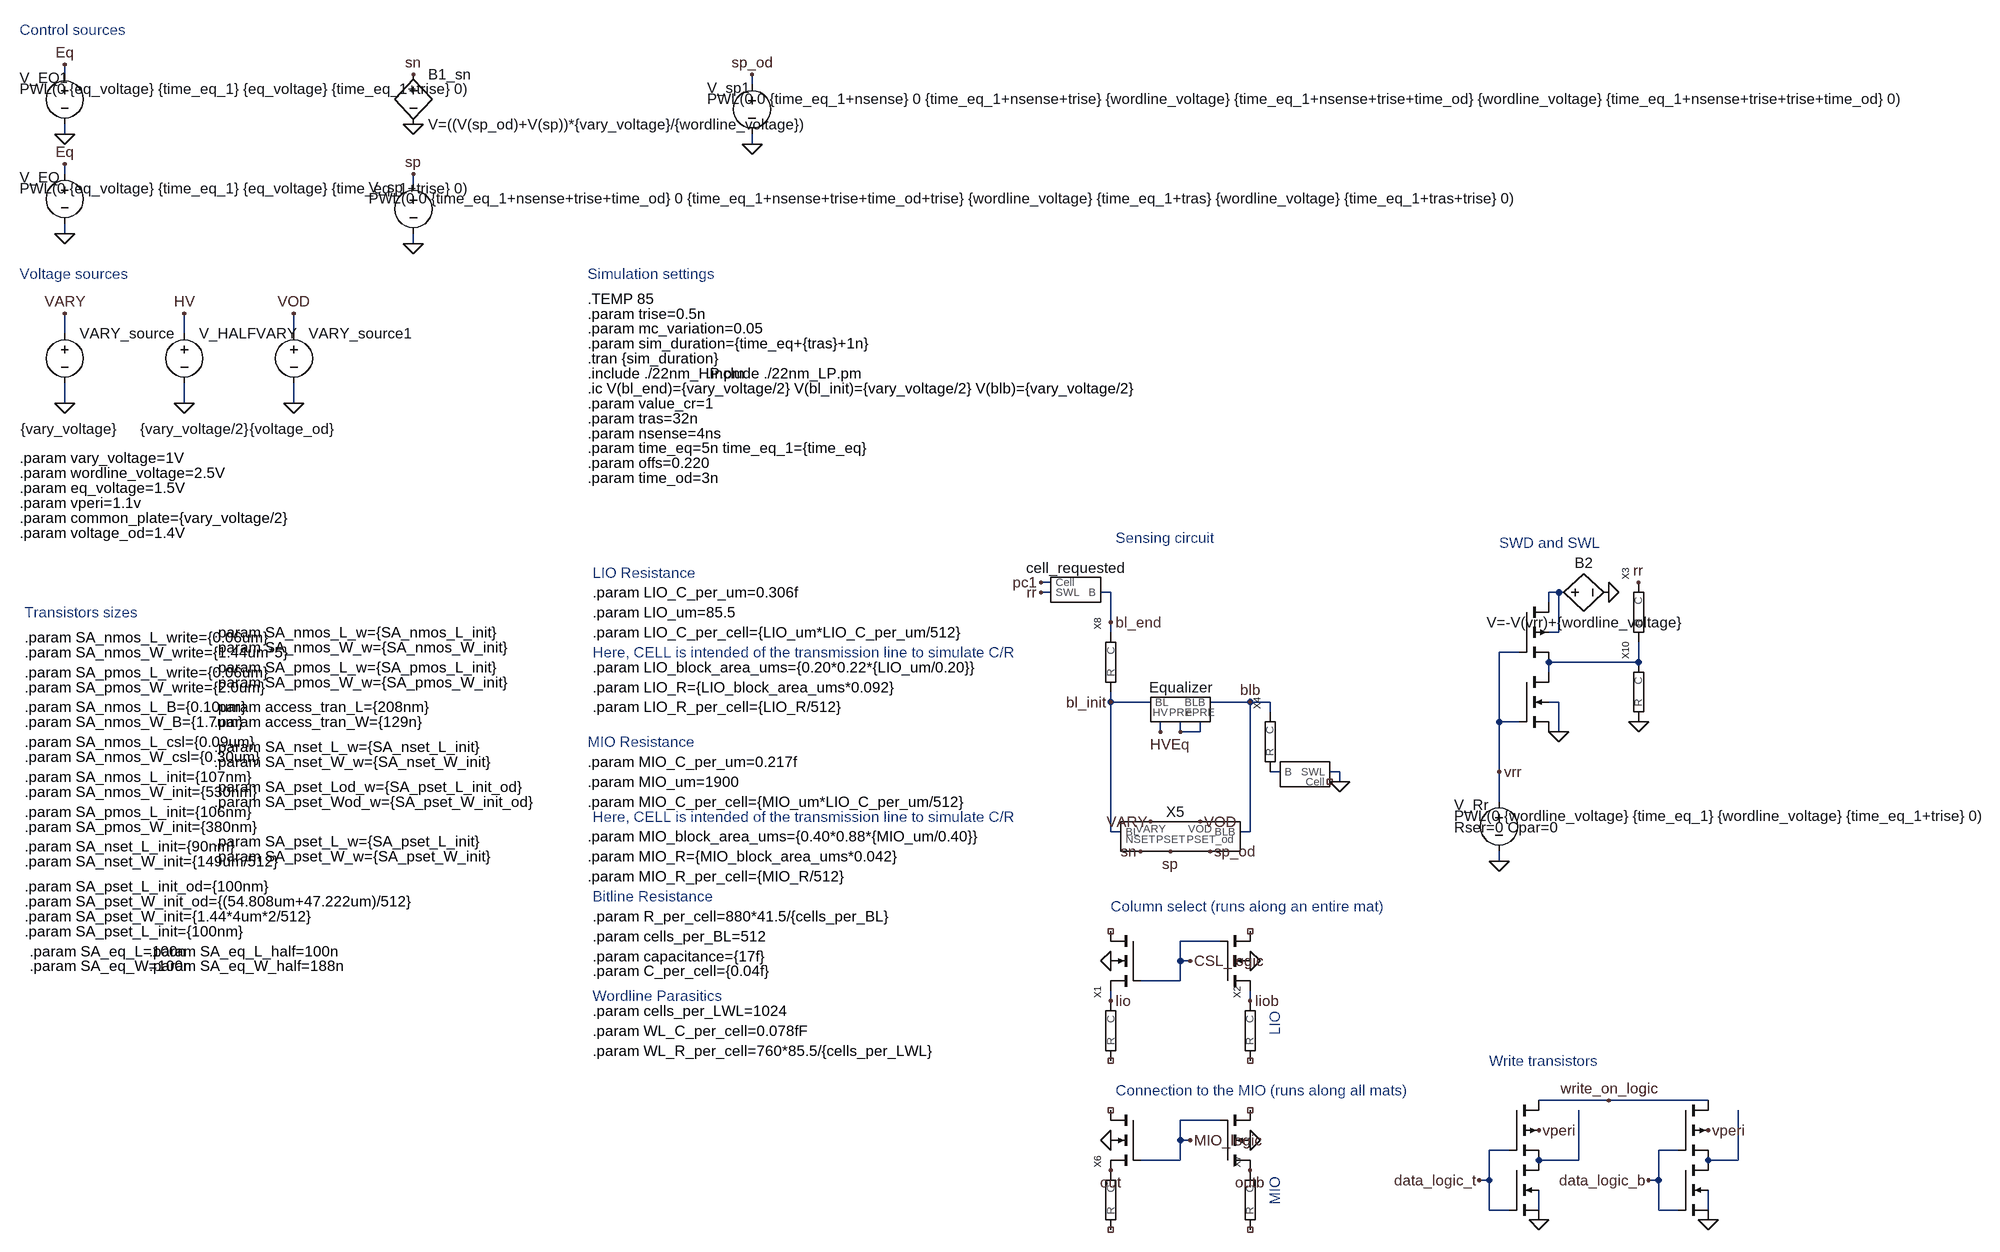
[diagram p0: schematic REM.asc]
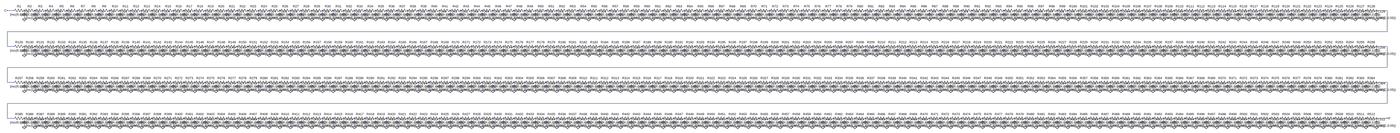
[diagram p1: sub-circuit transmission_line.asc, whole sheet]
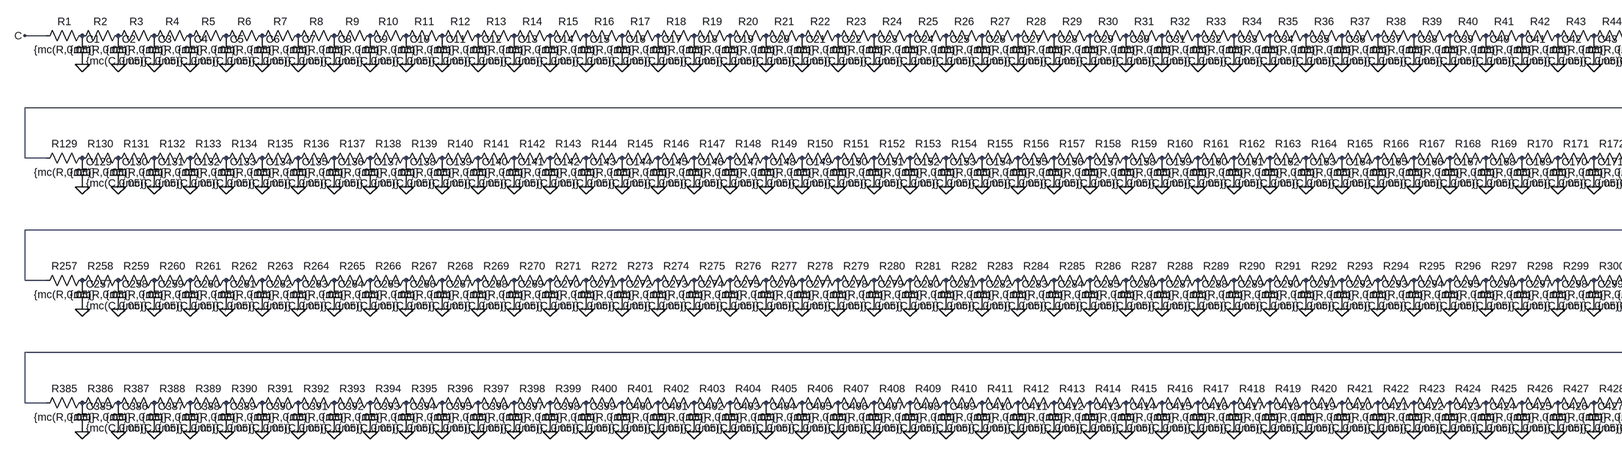
[diagram p2: sub-circuit transmission_line.asc, part, row 1 of 1, column 1 of 3]
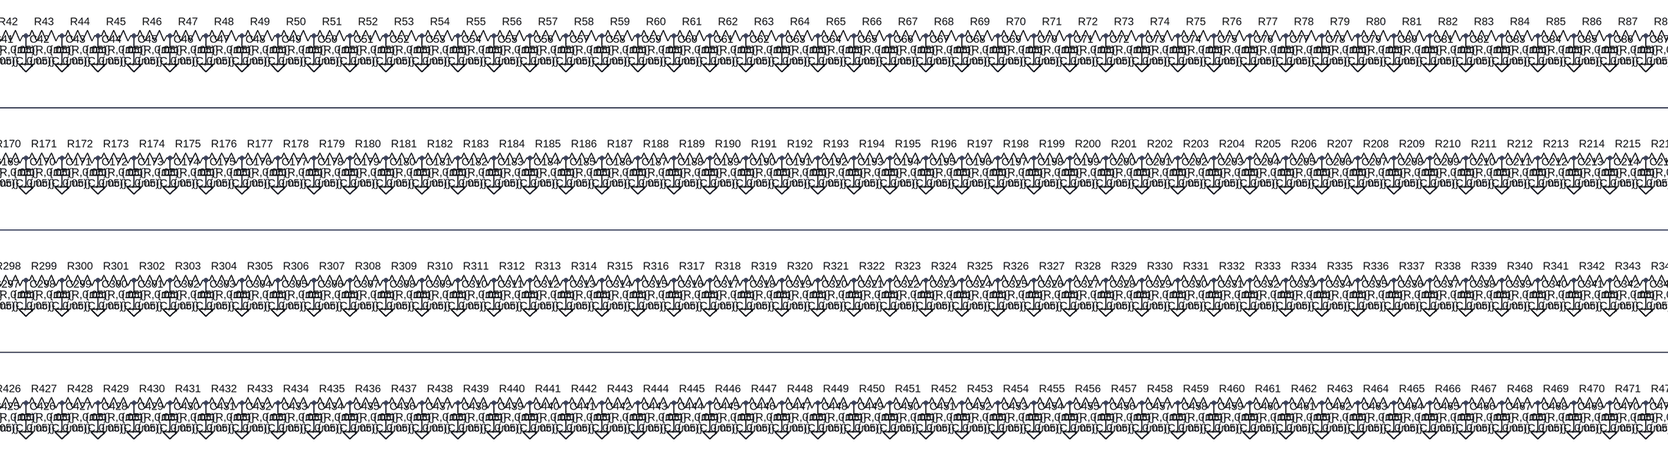
[diagram p3: sub-circuit transmission_line.asc, part, row 1 of 1, column 2 of 3]
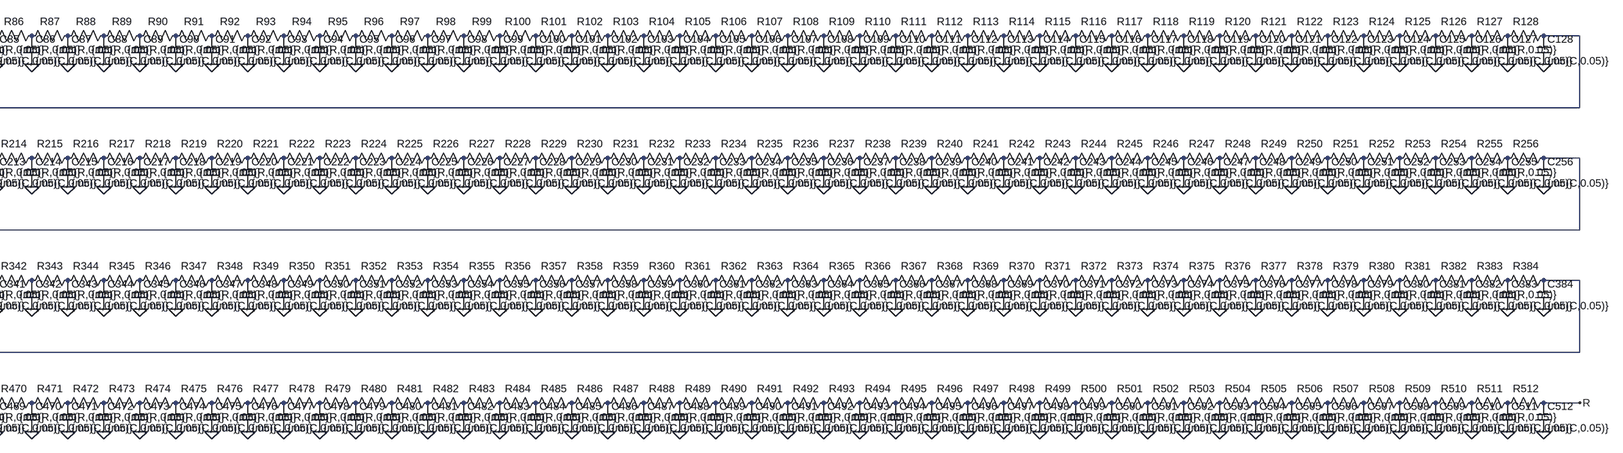
[diagram p4: sub-circuit transmission_line.asc, part, row 1 of 1, column 3 of 3]
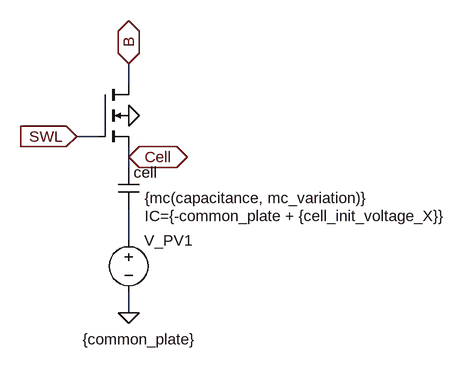
[diagram p5: sub-circuit dram_cell.asc]
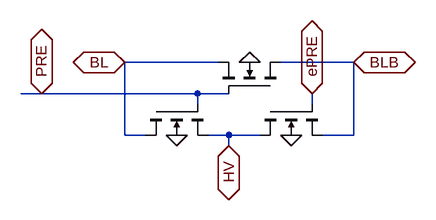
[diagram p6: sub-circuit equalizer.asc]
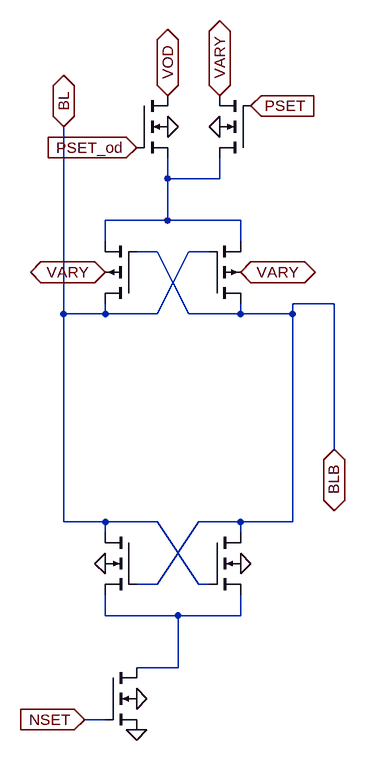
[diagram p7: sub-circuit sense_amplifier.asc]
REM.asc, the LTspice schematic file:
Version 4
SHEET 1 9124 2520
WIRE -800 -1040 -800 -1056
WIRE 304 -1024 304 -1040
WIRE -800 -944 -800 -960
WIRE 304 -928 304 -944
WIRE -800 -880 -800 -896
WIRE -240 -864 -240 -880
WIRE -800 -784 -800 -800
WIRE -240 -768 -240 -784
WIRE -800 -624 -800 -656
WIRE -608 -624 -608 -656
WIRE -432 -624 -432 -656
WIRE -800 -512 -800 -544
WIRE -608 -512 -608 -544
WIRE -432 -512 -432 -544
WIRE 784 -224 768 -224
WIRE 784 -208 768 -208
WIRE 880 -208 864 -208
WIRE 1600 -208 1584 -208
WIRE 1584 -192 1584 -208
WIRE 880 -160 880 -208
WIRE 880 -144 880 -160
WIRE 1600 -144 1600 -208
WIRE 1600 -144 1584 -144
WIRE 1536 -112 1504 -112
WIRE 1728 -96 1728 -128
WIRE 1728 -96 1584 -96
WIRE 1584 -80 1584 -96
WIRE 880 -32 880 -48
WIRE 944 -32 880 -32
WIRE 1104 -32 1040 -32
WIRE 1136 -32 1104 -32
WIRE 1600 -32 1584 -32
WIRE 1136 -16 1136 -32
WIRE 1504 0 1504 -112
WIRE 1536 0 1504 0
WIRE 960 16 960 0
WIRE 992 16 992 0
WIRE 1024 16 1024 0
WIRE 1024 16 992 16
WIRE 1600 16 1600 -32
WIRE 1600 16 1584 16
WIRE 1152 80 1136 80
WIRE 1248 80 1232 80
WIRE 1504 80 1504 0
WIRE 1248 96 1248 80
WIRE 1504 128 1504 80
WIRE 880 176 880 -32
WIRE 896 176 880 176
WIRE 1104 176 1104 -32
WIRE 1104 176 1088 176
WIRE 1504 224 1504 208
WIRE 1056 352 992 352
WIRE 992 384 992 352
WIRE 1008 384 992 384
WIRE 992 416 992 384
WIRE 992 416 928 416
WIRE 880 448 880 432
WIRE 1104 448 1104 432
WIRE 1680 608 1568 608
WIRE 1840 608 1680 608
WIRE 1056 640 992 640
WIRE 992 672 992 640
WIRE 1008 672 992 672
WIRE 1520 688 1488 688
WIRE 1792 688 1760 688
WIRE 992 704 992 672
WIRE 992 704 928 704
WIRE 1632 704 1632 624
WIRE 1632 704 1568 704
WIRE 1888 704 1888 624
WIRE 1888 704 1840 704
WIRE 1488 736 1488 688
WIRE 1488 736 1472 736
WIRE 1760 736 1760 688
WIRE 1760 736 1744 736
WIRE 1488 784 1488 736
WIRE 1520 784 1488 784
WIRE 1568 784 1568 752
WIRE 1760 784 1760 736
WIRE 1792 784 1760 784
WIRE 1840 784 1840 752
FLAG -800 -784 0
FLAG -800 -896 Eq
FLAG -800 -512 0
FLAG -800 -656 VARY
FLAG -608 -512 0
FLAG -608 -656 HV
FLAG 768 -208 rr
FLAG 768 -224 pc1
FLAG 1248 96 0
FLAG 880 -160 bl_end
FLAG 880 -32 bl_init
FLAG 960 16 HV
FLAG 992 16 Eq
FLAG -240 -960 0
FLAG -240 -1040 sn
FLAG -240 -768 0
FLAG -240 -880 sp
FLAG -432 -512 0
FLAG -432 -656 VOD
FLAG 1024 160 VOD
FLAG 928 208 sn
FLAG 1104 -32 blb
FLAG 944 160 VARY
FLAG 976 208 sp
FLAG 1040 208 sp_od
FLAG 304 -928 0
FLAG 304 -1040 sp_od
FLAG 1504 224 0
FLAG 1728 -224 rr
FLAG 1600 16 0
FLAG 1680 -208 0
FLAG 1504 80 vrr
FLAG 1728 0 0
FLAG -800 -944 0
FLAG -800 -1056 Eq
FLAG 1008 384 CSL_logic
FLAG 1104 384 0
FLAG 880 384 0
FLAG 880 448 lio
FLAG 1104 448 liob
FLAG 880 720 out
FLAG 1104 720 outb
FLAG 1008 672 MIO_logic
FLAG 1104 672 0
FLAG 880 672 0
FLAG 1568 800 0
FLAG 1680 608 write_on_logic
FLAG 1472 736 data_logic_t
FLAG 1568 656 vperi
FLAG 1840 800 0
FLAG 1744 736 data_logic_b
FLAG 1840 656 vperi
DATAFLAG 304 -1056 ""
DATAFLAG 304 -1056 ""
DATAFLAG 304 -1056 ""
DATAFLAG 768 -224 ""
DATAFLAG 768 -224 ""
DATAFLAG 768 -224 ""
DATAFLAG 768 -224 ""
SYMBOL voltage -800 -896 R0
WINDOW 0 -72 21 Left 2
WINDOW 3 -72 39 Left 2
WINDOW 123 0 0 Left 2
SYMATTR InstName V_EQ
SYMATTR Value PWL(0 {eq_voltage} {time_eq_1} {eq_voltage} {time_eq_1+trise} 0)
SYMATTR SpiceLine Rser=100 Cpar=1f
SYMBOL voltage -800 -640 R0
WINDOW 123 0 0 Left 2
WINDOW 39 -71 197 Left 2
WINDOW 3 -71 169 Left 2
SYMATTR Value {vary_voltage}
SYMATTR InstName VARY_source
SYMBOL voltage -608 -640 R0
WINDOW 123 0 0 Left 2
WINDOW 39 -71 197 Left 2
WINDOW 3 -71 169 Left 2
SYMATTR Value {vary_voltage/2}
SYMATTR InstName V_HALFVARY
SYMBOL transmission_line 1136 32 R270
SYMATTR InstName X4
SYMATTR SpiceLine R=R_per_cell C=C_per_cell
SYMBOL dram_cell 848 -192 R0
SYMATTR SpiceLine cell_init_voltage_X={if(value_cr==0,{vary_voltage/2-offs},{vary_voltage/2+offs})}
SYMATTR InstName cell_requested
SYMBOL dram_cell 1168 64 R180
WINDOW 0 -25 -40 Invisible 2
SYMATTR InstName cell3
SYMATTR SpiceLine cell_init_voltage_X={if(value_cr==0,{vary_voltage/2-offs},{vary_voltage/2+offs})}
SYMBOL transmission_line 880 -96 R270
SYMATTR InstName X8
SYMATTR SpiceLine R=R_per_cell C=C_per_cell
SYMBOL equalizer 976 16 R0
SYMATTR InstName Equalizer
SYMBOL bv -240 -1056 R0
SYMATTR InstName B1_sn
SYMATTR Value V=((V(sp_od)+V(sp))*{vary_voltage}/{wordline_voltage})
SYMBOL voltage -240 -880 R0
WINDOW 0 -72 21 Left 2
WINDOW 3 -72 39 Left 2
WINDOW 123 0 0 Left 2
SYMATTR InstName V_sp
SYMATTR Value PWL(0 0 {time_eq_1+nsense+trise+time_od} 0 {time_eq_1+nsense+trise+time_od+trise} {wordline_voltage} {time_eq_1+tras} {wordline_voltage} {time_eq_1+tras+trise} 0)
SYMATTR SpiceLine Rser=100 Cpar=1f
SYMBOL voltage -432 -640 R0
WINDOW 123 0 0 Left 2
WINDOW 39 -71 197 Left 2
WINDOW 3 -71 169 Left 2
SYMATTR Value {voltage_od}
SYMATTR InstName VARY_source1
SYMBOL sense_amplifier 960 224 R0
SYMATTR InstName X5
SYMATTR SpiceLine SA_nmos_L_=SA_nmos_L_w SA_nmos_W_=SA_nmos_W_w SA_pmos_L_=SA_pmos_L_w SA_pmos_W_=SA_pmos_W_w SA_nset_L_=SA_nset_L_w SA_nset_W_=SA_nset_W_w SA_pset_W_=SA_pset_W_w SA_pset_L_=SA_pset_L_w  SA_pset_Lod_=SA_pset_Lod_w SA_pset_Wod_=SA_pset_Wod_w
SYMBOL voltage 304 -1040 R0
WINDOW 0 -72 21 Left 2
WINDOW 3 -72 39 Left 2
WINDOW 123 0 0 Left 2
SYMATTR InstName V_sp1
SYMATTR Value PWL(0 0 {time_eq_1+nsense} 0 {time_eq_1+nsense+trise} {wordline_voltage} {time_eq_1+nsense+trise+time_od} {wordline_voltage} {time_eq_1+nsense+trise+trise+time_od} 0)
SYMATTR SpiceLine Rser=100 Cpar=1f
SYMBOL voltage 1504 112 R0
WINDOW 0 -72 21 Left 2
WINDOW 3 -72 39 Left 2
WINDOW 123 0 0 Left 2
WINDOW 39 -72 57 Left 2
SYMATTR InstName V_Rr
SYMATTR Value PWL(0 {wordline_voltage} {time_eq_1} {wordline_voltage} {time_eq_1+trise} 0)
SYMATTR SpiceLine Rser=0 Cpar=0
SYMBOL transmission_line 1728 -176 R270
SYMATTR SpiceLine R=WL_R_per_cell C=WL_C_per_cell
SYMATTR InstName X3
SYMBOL transmission_line 1728 -48 R270
SYMATTR SpiceLine R=WL_R_per_cell C=WL_C_per_cell
SYMATTR InstName X10
SYMBOL nmos4 1536 -80 R0
WINDOW 0 104 24 Invisible 2
WINDOW 3 179 41 Invisible 2
SYMATTR InstName M13
SYMATTR Value2 l={mc(0.1u,0.05)} w={mc(0.256u,0.05)}
SYMBOL pmos4 1536 -192 R0
WINDOW 0 56 32 Invisible 2
WINDOW 3 56 72 Invisible 2
SYMATTR InstName M14
SYMATTR Value2 l={mc(0.104u,0.05)} w={mc(0.908u,0.05)}
SYMBOL bv 1584 -208 R270
WINDOW 0 32 56 VTop 2
WINDOW 3 -32 56 VBottom 2
SYMATTR InstName B2
SYMATTR Value V=-V(vrr)+{wordline_voltage}
SYMBOL voltage -800 -1056 R0
WINDOW 0 -72 21 Left 2
WINDOW 3 -72 39 Left 2
WINDOW 123 0 0 Left 2
SYMATTR InstName V_EQ1
SYMATTR Value PWL(0 {eq_voltage} {time_eq_1} {eq_voltage} {time_eq_1+trise} 0)
SYMATTR SpiceLine Rser=100 Cpar=1f
SYMBOL nmos4 1056 432 M180
WINDOW 0 104 24 Invisible 2
WINDOW 3 179 41 Invisible 2
SYMATTR InstName M1
SYMATTR Value2 l={mc({SA_nmos_L_csl},mc_variation)} w={mc({SA_nmos_W_csl},mc_variation)}
SYMBOL nmos4 928 336 M0
WINDOW 0 104 24 Invisible 2
WINDOW 3 179 41 Invisible 2
SYMATTR InstName M2
SYMATTR Value2 l={mc({SA_nmos_L_csl},mc_variation)} w={mc({SA_nmos_W_csl},mc_variation)}
SYMBOL transmission_line 880 496 R270
SYMATTR InstName X1
SYMATTR SpiceLine R=LIO_R_per_cell C=LIO_C_per_cell
SYMBOL transmission_line 1104 496 R270
SYMATTR InstName X2
SYMATTR SpiceLine R=R_per_cell C=LIO_C_per_cell
SYMBOL transmission_line 880 768 R270
SYMATTR InstName X6
SYMATTR SpiceLine R=MIO_R_per_cell C=MIO_C_per_cell
SYMBOL transmission_line 1104 768 R270
SYMATTR InstName X7
SYMATTR SpiceLine R=R_per_cell C=LIO_C_per_cell
SYMBOL nmos4 928 624 M0
WINDOW 0 104 24 Invisible 2
WINDOW 3 179 41 Invisible 2
SYMATTR InstName M3
SYMATTR Value2 l={mc({SA_nmos_L_B},mc_variation)} w={mc({SA_nmos_W_B},mc_variation)}
SYMBOL nmos4 1056 720 M180
WINDOW 0 104 24 Invisible 2
WINDOW 3 179 41 Invisible 2
SYMATTR InstName M4
SYMATTR Value2 l={mc({SA_nmos_L_B},mc_variation)} w={mc({SA_nmos_W_B},mc_variation)}
SYMBOL nmos4 1520 704 R0
WINDOW 0 56 32 Invisible 2
WINDOW 3 56 72 Invisible 2
SYMATTR InstName M5
SYMATTR Value2 l={mc(SA_nmos_L_write, mc_variation)} w={mc(SA_nmos_W_write, mc_variation)}
SYMBOL pmos4 1520 608 R0
WINDOW 0 56 32 Invisible 2
WINDOW 3 56 72 Invisible 2
SYMATTR InstName M6
SYMATTR Value2 l={mc(SA_pmos_L_write, mc_variation)} w={mc(SA_pmos_W_write, mc_variation)}
SYMBOL nmos4 1792 704 R0
WINDOW 0 56 32 Invisible 2
WINDOW 3 56 72 Invisible 2
SYMATTR InstName M7
SYMATTR Value2 l={mc(SA_nmos_L_write, mc_variation)} w={mc(SA_nmos_W_write, mc_variation)}
SYMBOL pmos4 1792 608 R0
WINDOW 0 56 32 Invisible 2
WINDOW 3 56 72 Invisible 2
SYMATTR InstName M8
SYMATTR Value2 l={mc(SA_pmos_L_write, mc_variation)} w={mc(SA_pmos_W_write, mc_variation)}
TEXT 40 -560 Left 2 !.include ./22nm_HP.pm
TEXT 40 -584 Left 2 !.tran {sim_duration}
TEXT 40 -632 Left 2 !.param mc_variation=0.05
TEXT 48 376 Left 2 !.param capacitance={17f}
TEXT 48 400 Left 2 !.param C_per_cell={0.04f}
TEXT -560 -24 Left 2 !.param access_tran_L={208nm}
TEXT -560 0 Left 2 !.param access_tran_W={129n}
TEXT 48 312 Left 2 !.param R_per_cell=880*41.5/{cells_per_BL}
TEXT 48 280 Left 2 ;Bitline Resistance
TEXT -856 368 Left 2 !.param SA_eq_L=100n
TEXT -856 392 Left 2 !.param SA_eq_W=100n
TEXT 48 344 Left 2 !.param cells_per_BL=512
TEXT -872 -424 Left 2 !.param vary_voltage=1V
TEXT -872 -400 Left 2 !.param wordline_voltage=2.5V
TEXT -872 -328 Left 2 !.param common_plate={vary_voltage/2}
TEXT 40 -464 Left 2 !.param nsense=4ns
TEXT 48 496 Left 2 !.param WL_C_per_cell=0.078fF
TEXT 48 440 Left 2 ;Wordline Parasitics
TEXT 48 464 Left 2 !.param cells_per_LWL=1024
TEXT 48 528 Left 2 !.param WL_R_per_cell=760*85.5/{cells_per_LWL}
TEXT 40 -680 Left 2 !.TEMP 85
TEXT 40 -488 Left 2 !.param tras=32n
TEXT 40 -656 Left 2 !.param trise=0.5n
TEXT -560 -144 Left 2 !.param SA_nmos_L_w={SA_nmos_L_init}
TEXT -560 -120 Left 2 !.param SA_nmos_W_w={SA_nmos_W_init}
TEXT -560 -88 Left 2 !.param SA_pmos_L_w={SA_pmos_L_init}
TEXT -560 -64 Left 2 !.param SA_pmos_W_w={SA_pmos_W_init}
TEXT -560 40 Left 2 !.param SA_nset_L_w={SA_nset_L_init}
TEXT -560 64 Left 2 !.param SA_nset_W_w={SA_nset_W_init}
TEXT -560 104 Left 2 !.param SA_pset_Lod_w={SA_pset_L_init_od}
TEXT -560 128 Left 2 !.param SA_pset_Wod_w={SA_pset_W_init_od}
TEXT 40 -440 Left 2 !.param time_eq=5n time_eq_1={time_eq}
TEXT 40 -608 Left 2 !.param sim_duration={time_eq+{tras}+1n}
TEXT -664 368 Left 2 !.param SA_eq_L_half=100n
TEXT -664 392 Left 2 !.param SA_eq_W_half=188n
TEXT -864 88 Left 2 !.param SA_nmos_L_init={107nm}
TEXT -864 112 Left 2 !.param SA_nmos_W_init={530nm}
TEXT -864 144 Left 2 !.param SA_pmos_L_init={106nm}
TEXT -864 168 Left 2 !.param SA_pmos_W_init={380nm}
TEXT -864 200 Left 2 !.param SA_nset_L_init={90nm}
TEXT -864 224 Left 2 !.param SA_nset_W_init={149um/512}
TEXT -864 264 Left 2 !.param SA_pset_L_init_od={100nm}
TEXT -864 288 Left 2 !.param SA_pset_W_init_od={(54.808um+47.222um)/512}
TEXT -864 312 Left 2 !.param SA_pset_W_init={1.44*4um*2/512}
TEXT 40 -536 Left 2 !.ic V(bl_end)={vary_voltage/2} V(bl_init)={vary_voltage/2} V(blb)={vary_voltage/2}
TEXT -872 -376 Left 2 !.param eq_voltage=1.5V
TEXT 48 -144 Left 2 !.param LIO_C_per_cell={LIO_um*LIO_C_per_um/512}
TEXT 48 -208 Left 2 !.param LIO_C_per_um=0.306f
TEXT 48 -240 Left 2 ;LIO Resistance
TEXT 48 -176 Left 2 !.param LIO_um=85.5
TEXT 48 -112 Left 2 ;Here, CELL is intended of the transmission line to simulate C/R
TEXT 48 -88 Left 2 !.param LIO_block_area_ums={0.20*0.22*{LIO_um/0.20}}
TEXT 48 -56 Left 2 !.param LIO_R={LIO_block_area_ums*0.092}
TEXT 48 -24 Left 2 !.param LIO_R_per_cell={LIO_R/512}
TEXT 40 128 Left 2 !.param MIO_C_per_cell={MIO_um*LIO_C_per_um/512}
TEXT 40 64 Left 2 !.param MIO_C_per_um=0.217f
TEXT 40 32 Left 2 ;MIO Resistance
TEXT 40 96 Left 2 !.param MIO_um=1900
TEXT 48 152 Left 2 ;Here, CELL is intended of the transmission line to simulate C/R
TEXT 40 184 Left 2 !.param MIO_block_area_ums={0.40*0.88*{MIO_um/0.40}}
TEXT 40 216 Left 2 !.param MIO_R={MIO_block_area_ums*0.042}
TEXT 40 248 Left 2 !.param MIO_R_per_cell={MIO_R/512}
TEXT -872 -352 Left 2 !.param vperi=1.1v
TEXT -864 -24 Left 2 !.param SA_nmos_L_B={0.10um}
TEXT -864 0 Left 2 !.param SA_nmos_W_B={1.7um}
TEXT -864 32 Left 2 !.param SA_nmos_L_csl={0.09um}
TEXT -864 56 Left 2 !.param SA_nmos_W_csl={0.30um}
TEXT -864 -136 Left 2 !.param SA_nmos_L_write={0.06um}
TEXT -864 -112 Left 2 !.param SA_nmos_W_write={1.44um*5}
TEXT -864 -80 Left 2 !.param SA_pmos_L_write={0.06um}
TEXT -864 -56 Left 2 !.param SA_pmos_W_write={2.0um}
TEXT 40 -416 Left 2 !.param offs=0.220
TEXT -864 336 Left 2 !.param SA_pset_L_init={100nm}
TEXT -872 -304 Left 2 !.param voltage_od=1.4V
TEXT -560 192 Left 2 !.param SA_pset_L_w={SA_pset_L_init}
TEXT -560 216 Left 2 !.param SA_pset_W_w={SA_pset_W_init}
TEXT 40 -392 Left 2 !.param time_od=3n
TEXT 40 -512 Left 2 !.param value_cr=1
TEXT -872 -720 Left 2 ;Voltage sources
TEXT -872 -1112 Left 2 ;Control sources
TEXT 1504 -288 Left 2 ;SWD and SWL
TEXT 40 -720 Left 2 ;Simulation settings
TEXT -864 -176 Left 2 ;Transistors sizes
TEXT 888 -296 Left 2 ;Sensing circuit
TEXT 880 296 Left 2 ;Column select (runs along an entire mat)
TEXT 1144 504 VLeft 2 ;LIO
TEXT 1144 776 VLeft 2 ;MIO
TEXT 888 592 Left 2 ;Connection to the MIO (runs along all mats)
TEXT 1488 544 Left 2 ;Write transistors
TEXT 232 -560 Left 2 !.include ./22nm_LP.pm

The netlist it stands for:
* REM.asc
V_EQ Eq 0 PWL(0 {eq_voltage} {time_eq_1} {eq_voltage} {time_eq_1+trise} 0) Rser=100 Cpar=1f
VARY_source VARY 0 {vary_voltage}
V_HALFVARY HV 0 {vary_voltage/2}
XX4 N003 blb transmission_line params: R=R_per_cell C=C_per_cell
Xcell_requested rr bl_end pc1 dram_cell params: cell_init_voltage_X={if(value_cr==0,{vary_voltage/2-offs},{vary_voltage/2+offs})}
Xcell3 0 N003 NC_01 dram_cell params: cell_init_voltage_X={if(value_cr==0,{vary_voltage/2-offs},{vary_voltage/2+offs})}
XX8 bl_init bl_end transmission_line params: R=R_per_cell C=C_per_cell
XEqualizer bl_init blb Eq HV Eq equalizer
B1_sn sn 0 V=((V(sp_od)+V(sp))*{vary_voltage}/{wordline_voltage})
V_sp sp 0 PWL(0 0 {time_eq_1+nsense+trise+time_od} 0 {time_eq_1+nsense+trise+time_od+trise} {wordline_voltage} {time_eq_1+tras} {wordline_voltage} {time_eq_1+tras+trise} 0) Rser=100 Cpar=1f
VARY_source1 VOD 0 {voltage_od}
XX5 sn sp sp_od bl_init blb VARY VOD sense_amplifier params: SA_nmos_L_=SA_nmos_L_w SA_nmos_W_=SA_nmos_W_w SA_pmos_L_=SA_pmos_L_w SA_pmos_W_=SA_pmos_W_w SA_nset_L_=SA_nset_L_w SA_nset_W_=SA_nset_W_w SA_pset_W_=SA_pset_W_w SA_pset_L_=SA_pset_L_w  SA_pset_Lod_=SA_pset_Lod_w SA_pset_Wod_=SA_pset_Wod_w
V_sp1 sp_od 0 PWL(0 0 {time_eq_1+nsense} 0 {time_eq_1+nsense+trise} {wordline_voltage} {time_eq_1+nsense+trise+time_od} {wordline_voltage} {time_eq_1+nsense+trise+trise+time_od} 0) Rser=100 Cpar=1f
V_Rr vrr 0 PWL(0 {wordline_voltage} {time_eq_1} {wordline_voltage} {time_eq_1+trise} 0) Rser=0 Cpar=0
XX3 N002 rr transmission_line params: R=WL_R_per_cell C=WL_C_per_cell
XX10 0 N002 transmission_line params: R=WL_R_per_cell C=WL_C_per_cell
M13 N002 vrr 0 0 NMOS l={mc(0.1u,0.05)} w={mc(0.256u,0.05)}
M14 N001 vrr N002 N001 PMOS l={mc(0.104u,0.05)} w={mc(0.908u,0.05)}
B2 N001 0 V=-V(vrr)+{wordline_voltage}
V_EQ1 Eq 0 PWL(0 {eq_voltage} {time_eq_1} {eq_voltage} {time_eq_1+trise} 0) Rser=100 Cpar=1f
M1 liob CSL_logic NC_02 0 NMOS l={mc({SA_nmos_L_csl},mc_variation)} w={mc({SA_nmos_W_csl},mc_variation)}
M2 NC_03 CSL_logic lio 0 NMOS l={mc({SA_nmos_L_csl},mc_variation)} w={mc({SA_nmos_W_csl},mc_variation)}
XX1 NC_04 lio transmission_line params: R=LIO_R_per_cell C=LIO_C_per_cell
XX2 NC_05 liob transmission_line params: R=R_per_cell C=LIO_C_per_cell
XX6 NC_06 out transmission_line params: R=MIO_R_per_cell C=MIO_C_per_cell
XX7 NC_07 outb transmission_line params: R=R_per_cell C=LIO_C_per_cell
M3 NC_08 MIO_logic out 0 NMOS l={mc({SA_nmos_L_B},mc_variation)} w={mc({SA_nmos_W_B},mc_variation)}
M4 outb MIO_logic NC_09 0 NMOS l={mc({SA_nmos_L_B},mc_variation)} w={mc({SA_nmos_W_B},mc_variation)}
M5 N004 data_logic_t 0 N006 NMOS l={mc(SA_nmos_L_write, mc_variation)} w={mc(SA_nmos_W_write, mc_variation)}
M6 write_on_logic data_logic_t N004 vperi PMOS l={mc(SA_pmos_L_write, mc_variation)} w={mc(SA_pmos_W_write, mc_variation)}
M7 N005 data_logic_b 0 N007 NMOS l={mc(SA_nmos_L_write, mc_variation)} w={mc(SA_nmos_W_write, mc_variation)}
M8 write_on_logic data_logic_b N005 vperi PMOS l={mc(SA_pmos_L_write, mc_variation)} w={mc(SA_pmos_W_write, mc_variation)}

* block symbol definitions
.subckt transmission_line R C
R1 P001 C {mc(R,0.05)}
C1 P001 0 {mc(C,0.05)}
R2 P002 P001 {mc(R,0.05)}
C2 P002 0 {mc(C,0.05)}
R3 P003 P002 {mc(R,0.05)}
C3 P003 0 {mc(C,0.05)}
R4 P004 P003 {mc(R,0.05)}
C4 P004 0 {mc(C,0.05)}
R5 P005 P004 {mc(R,0.05)}
C5 P005 0 {mc(C,0.05)}
R6 P006 P005 {mc(R,0.05)}
C6 P006 0 {mc(C,0.05)}
R7 P007 P006 {mc(R,0.05)}
C7 P007 0 {mc(C,0.05)}
R8 P008 P007 {mc(R,0.05)}
C8 P008 0 {mc(C,0.05)}
R9 P009 P008 {mc(R,0.05)}
C9 P009 0 {mc(C,0.05)}
R10 P010 P009 {mc(R,0.05)}
C10 P010 0 {mc(C,0.05)}
R11 P011 P010 {mc(R,0.05)}
C11 P011 0 {mc(C,0.05)}
R12 P012 P011 {mc(R,0.05)}
C12 P012 0 {mc(C,0.05)}
R13 P013 P012 {mc(R,0.05)}
C13 P013 0 {mc(C,0.05)}
R14 P014 P013 {mc(R,0.05)}
C14 P014 0 {mc(C,0.05)}
R15 P015 P014 {mc(R,0.05)}
C15 P015 0 {mc(C,0.05)}
R16 P016 P015 {mc(R,0.05)}
C16 P016 0 {mc(C,0.05)}
R17 P017 P016 {mc(R,0.05)}
C17 P017 0 {mc(C,0.05)}
R18 P018 P017 {mc(R,0.05)}
C18 P018 0 {mc(C,0.05)}
R19 P019 P018 {mc(R,0.05)}
C19 P019 0 {mc(C,0.05)}
R20 P020 P019 {mc(R,0.05)}
C20 P020 0 {mc(C,0.05)}
R21 P021 P020 {mc(R,0.05)}
C21 P021 0 {mc(C,0.05)}
R22 P022 P021 {mc(R,0.05)}
C22 P022 0 {mc(C,0.05)}
R23 P023 P022 {mc(R,0.05)}
C23 P023 0 {mc(C,0.05)}
R24 P024 P023 {mc(R,0.05)}
C24 P024 0 {mc(C,0.05)}
R25 P025 P024 {mc(R,0.05)}
C25 P025 0 {mc(C,0.05)}
R26 P026 P025 {mc(R,0.05)}
C26 P026 0 {mc(C,0.05)}
R27 P027 P026 {mc(R,0.05)}
C27 P027 0 {mc(C,0.05)}
R28 P028 P027 {mc(R,0.05)}
C28 P028 0 {mc(C,0.05)}
R29 P029 P028 {mc(R,0.05)}
C29 P029 0 {mc(C,0.05)}
R30 P030 P029 {mc(R,0.05)}
C30 P030 0 {mc(C,0.05)}
R31 P031 P030 {mc(R,0.05)}
C31 P031 0 {mc(C,0.05)}
R32 P032 P031 {mc(R,0.05)}
C32 P032 0 {mc(C,0.05)}
R33 P033 P032 {mc(R,0.05)}
C33 P033 0 {mc(C,0.05)}
R34 P034 P033 {mc(R,0.05)}
C34 P034 0 {mc(C,0.05)}
R35 P035 P034 {mc(R,0.05)}
C35 P035 0 {mc(C,0.05)}
R36 P036 P035 {mc(R,0.05)}
C36 P036 0 {mc(C,0.05)}
R37 P037 P036 {mc(R,0.05)}
C37 P037 0 {mc(C,0.05)}
R38 P038 P037 {mc(R,0.05)}
C38 P038 0 {mc(C,0.05)}
R39 P039 P038 {mc(R,0.05)}
C39 P039 0 {mc(C,0.05)}
R40 P040 P039 {mc(R,0.05)}
C40 P040 0 {mc(C,0.05)}
R41 P041 P040 {mc(R,0.05)}
C41 P041 0 {mc(C,0.05)}
R42 P042 P041 {mc(R,0.05)}
C42 P042 0 {mc(C,0.05)}
R43 P043 P042 {mc(R,0.05)}
C43 P043 0 {mc(C,0.05)}
R44 P044 P043 {mc(R,0.05)}
C44 P044 0 {mc(C,0.05)}
R45 P045 P044 {mc(R,0.05)}
C45 P045 0 {mc(C,0.05)}
R46 P046 P045 {mc(R,0.05)}
C46 P046 0 {mc(C,0.05)}
R47 P047 P046 {mc(R,0.05)}
C47 P047 0 {mc(C,0.05)}
R48 P048 P047 {mc(R,0.05)}
C48 P048 0 {mc(C,0.05)}
R49 P049 P048 {mc(R,0.05)}
C49 P049 0 {mc(C,0.05)}
R50 P050 P049 {mc(R,0.05)}
C50 P050 0 {mc(C,0.05)}
R51 P051 P050 {mc(R,0.05)}
C51 P051 0 {mc(C,0.05)}
R52 P052 P051 {mc(R,0.05)}
C52 P052 0 {mc(C,0.05)}
R53 P053 P052 {mc(R,0.05)}
C53 P053 0 {mc(C,0.05)}
R54 P054 P053 {mc(R,0.05)}
C54 P054 0 {mc(C,0.05)}
R55 P055 P054 {mc(R,0.05)}
C55 P055 0 {mc(C,0.05)}
R56 P056 P055 {mc(R,0.05)}
C56 P056 0 {mc(C,0.05)}
R57 P057 P056 {mc(R,0.05)}
C57 P057 0 {mc(C,0.05)}
R58 P058 P057 {mc(R,0.05)}
C58 P058 0 {mc(C,0.05)}
R59 P059 P058 {mc(R,0.05)}
C59 P059 0 {mc(C,0.05)}
R60 P060 P059 {mc(R,0.05)}
C60 P060 0 {mc(C,0.05)}
R61 P061 P060 {mc(R,0.05)}
C61 P061 0 {mc(C,0.05)}
R62 P062 P061 {mc(R,0.05)}
C62 P062 0 {mc(C,0.05)}
R63 P063 P062 {mc(R,0.05)}
C63 P063 0 {mc(C,0.05)}
R64 P064 P063 {mc(R,0.05)}
C64 P064 0 {mc(C,0.05)}
R65 P065 P064 {mc(R,0.05)}
C65 P065 0 {mc(C,0.05)}
R66 P066 P065 {mc(R,0.05)}
C66 P066 0 {mc(C,0.05)}
R67 P067 P066 {mc(R,0.05)}
C67 P067 0 {mc(C,0.05)}
R68 P068 P067 {mc(R,0.05)}
C68 P068 0 {mc(C,0.05)}
R69 P069 P068 {mc(R,0.05)}
C69 P069 0 {mc(C,0.05)}
R70 P070 P069 {mc(R,0.05)}
C70 P070 0 {mc(C,0.05)}
R71 P071 P070 {mc(R,0.05)}
C71 P071 0 {mc(C,0.05)}
R72 P072 P071 {mc(R,0.05)}
C72 P072 0 {mc(C,0.05)}
R73 P073 P072 {mc(R,0.05)}
C73 P073 0 {mc(C,0.05)}
R74 P074 P073 {mc(R,0.05)}
C74 P074 0 {mc(C,0.05)}
R75 P075 P074 {mc(R,0.05)}
C75 P075 0 {mc(C,0.05)}
R76 P076 P075 {mc(R,0.05)}
C76 P076 0 {mc(C,0.05)}
R77 P077 P076 {mc(R,0.05)}
C77 P077 0 {mc(C,0.05)}
R78 P078 P077 {mc(R,0.05)}
C78 P078 0 {mc(C,0.05)}
R79 P079 P078 {mc(R,0.05)}
C79 P079 0 {mc(C,0.05)}
R80 P080 P079 {mc(R,0.05)}
C80 P080 0 {mc(C,0.05)}
R81 P081 P080 {mc(R,0.05)}
C81 P081 0 {mc(C,0.05)}
R82 P082 P081 {mc(R,0.05)}
C82 P082 0 {mc(C,0.05)}
R83 P083 P082 {mc(R,0.05)}
C83 P083 0 {mc(C,0.05)}
R84 P084 P083 {mc(R,0.05)}
C84 P084 0 {mc(C,0.05)}
R85 P085 P084 {mc(R,0.05)}
C85 P085 0 {mc(C,0.05)}
R86 P086 P085 {mc(R,0.05)}
C86 P086 0 {mc(C,0.05)}
R87 P087 P086 {mc(R,0.05)}
C87 P087 0 {mc(C,0.05)}
R88 P088 P087 {mc(R,0.05)}
C88 P088 0 {mc(C,0.05)}
R89 P089 P088 {mc(R,0.05)}
C89 P089 0 {mc(C,0.05)}
R90 P090 P089 {mc(R,0.05)}
C90 P090 0 {mc(C,0.05)}
R91 P091 P090 {mc(R,0.05)}
C91 P091 0 {mc(C,0.05)}
R92 P092 P091 {mc(R,0.05)}
C92 P092 0 {mc(C,0.05)}
R93 P093 P092 {mc(R,0.05)}
C93 P093 0 {mc(C,0.05)}
R94 P094 P093 {mc(R,0.05)}
C94 P094 0 {mc(C,0.05)}
R95 P095 P094 {mc(R,0.05)}
C95 P095 0 {mc(C,0.05)}
R96 P096 P095 {mc(R,0.05)}
C96 P096 0 {mc(C,0.05)}
R97 P097 P096 {mc(R,0.05)}
C97 P097 0 {mc(C,0.05)}
R98 P098 P097 {mc(R,0.05)}
C98 P098 0 {mc(C,0.05)}
R99 P099 P098 {mc(R,0.05)}
C99 P099 0 {mc(C,0.05)}
R100 P100 P099 {mc(R,0.05)}
C100 P100 0 {mc(C,0.05)}
R101 P101 P100 {mc(R,0.05)}
C101 P101 0 {mc(C,0.05)}
R102 P102 P101 {mc(R,0.05)}
C102 P102 0 {mc(C,0.05)}
R103 P103 P102 {mc(R,0.05)}
C103 P103 0 {mc(C,0.05)}
R104 P104 P103 {mc(R,0.05)}
C104 P104 0 {mc(C,0.05)}
R105 P105 P104 {mc(R,0.05)}
C105 P105 0 {mc(C,0.05)}
R106 P106 P105 {mc(R,0.05)}
C106 P106 0 {mc(C,0.05)}
R107 P107 P106 {mc(R,0.05)}
C107 P107 0 {mc(C,0.05)}
R108 P108 P107 {mc(R,0.05)}
C108 P108 0 {mc(C,0.05)}
R109 P109 P108 {mc(R,0.05)}
C109 P109 0 {mc(C,0.05)}
R110 P110 P109 {mc(R,0.05)}
C110 P110 0 {mc(C,0.05)}
R111 P111 P110 {mc(R,0.05)}
C111 P111 0 {mc(C,0.05)}
R112 P112 P111 {mc(R,0.05)}
C112 P112 0 {mc(C,0.05)}
R113 P113 P112 {mc(R,0.05)}
C113 P113 0 {mc(C,0.05)}
R114 P114 P113 {mc(R,0.05)}
C114 P114 0 {mc(C,0.05)}
R115 P115 P114 {mc(R,0.05)}
C115 P115 0 {mc(C,0.05)}
R116 P116 P115 {mc(R,0.05)}
C116 P116 0 {mc(C,0.05)}
R117 P117 P116 {mc(R,0.05)}
C117 P117 0 {mc(C,0.05)}
R118 P118 P117 {mc(R,0.05)}
C118 P118 0 {mc(C,0.05)}
R119 P119 P118 {mc(R,0.05)}
C119 P119 0 {mc(C,0.05)}
R120 P120 P119 {mc(R,0.05)}
C120 P120 0 {mc(C,0.05)}
R121 P121 P120 {mc(R,0.05)}
C121 P121 0 {mc(C,0.05)}
R122 P122 P121 {mc(R,0.05)}
C122 P122 0 {mc(C,0.05)}
R123 P123 P122 {mc(R,0.05)}
C123 P123 0 {mc(C,0.05)}
R124 P124 P123 {mc(R,0.05)}
C124 P124 0 {mc(C,0.05)}
R125 P125 P124 {mc(R,0.05)}
C125 P125 0 {mc(C,0.05)}
R126 P126 P125 {mc(R,0.05)}
C126 P126 0 {mc(C,0.05)}
R127 P127 P126 {mc(R,0.05)}
C127 P127 0 {mc(C,0.05)}
R128 N001 P127 {mc(R,0.05)}
C128 N001 0 {mc(C,0.05)}
R129 P128 N001 {mc(R,0.05)}
C129 P128 0 {mc(C,0.05)}
R130 P129 P128 {mc(R,0.05)}
C130 P129 0 {mc(C,0.05)}
R131 P130 P129 {mc(R,0.05)}
C131 P130 0 {mc(C,0.05)}
R132 P131 P130 {mc(R,0.05)}
C132 P131 0 {mc(C,0.05)}
R133 P132 P131 {mc(R,0.05)}
C133 P132 0 {mc(C,0.05)}
R134 P133 P132 {mc(R,0.05)}
C134 P133 0 {mc(C,0.05)}
R135 P134 P133 {mc(R,0.05)}
C135 P134 0 {mc(C,0.05)}
R136 P135 P134 {mc(R,0.05)}
C136 P135 0 {mc(C,0.05)}
R137 P136 P135 {mc(R,0.05)}
C137 P136 0 {mc(C,0.05)}
R138 P137 P136 {mc(R,0.05)}
C138 P137 0 {mc(C,0.05)}
R139 P138 P137 {mc(R,0.05)}
C139 P138 0 {mc(C,0.05)}
R140 P139 P138 {mc(R,0.05)}
C140 P139 0 {mc(C,0.05)}
R141 P140 P139 {mc(R,0.05)}
C141 P140 0 {mc(C,0.05)}
R142 P141 P140 {mc(R,0.05)}
C142 P141 0 {mc(C,0.05)}
R143 P142 P141 {mc(R,0.05)}
C143 P142 0 {mc(C,0.05)}
R144 P143 P142 {mc(R,0.05)}
C144 P143 0 {mc(C,0.05)}
R145 P144 P143 {mc(R,0.05)}
C145 P144 0 {mc(C,0.05)}
R146 P145 P144 {mc(R,0.05)}
C146 P145 0 {mc(C,0.05)}
R147 P146 P145 {mc(R,0.05)}
C147 P146 0 {mc(C,0.05)}
R148 P147 P146 {mc(R,0.05)}
C148 P147 0 {mc(C,0.05)}
R149 P148 P147 {mc(R,0.05)}
C149 P148 0 {mc(C,0.05)}
R150 P149 P148 {mc(R,0.05)}
C150 P149 0 {mc(C,0.05)}
R151 P150 P149 {mc(R,0.05)}
C151 P150 0 {mc(C,0.05)}
R152 P151 P150 {mc(R,0.05)}
C152 P151 0 {mc(C,0.05)}
R153 P152 P151 {mc(R,0.05)}
C153 P152 0 {mc(C,0.05)}
R154 P153 P152 {mc(R,0.05)}
C154 P153 0 {mc(C,0.05)}
R155 P154 P153 {mc(R,0.05)}
C155 P154 0 {mc(C,0.05)}
R156 P155 P154 {mc(R,0.05)}
C156 P155 0 {mc(C,0.05)}
R157 P156 P155 {mc(R,0.05)}
C157 P156 0 {mc(C,0.05)}
R158 P157 P156 {mc(R,0.05)}
C158 P157 0 {mc(C,0.05)}
R159 P158 P157 {mc(R,0.05)}
C159 P158 0 {mc(C,0.05)}
R160 P159 P158 {mc(R,0.05)}
C160 P159 0 {mc(C,0.05)}
R161 P160 P159 {mc(R,0.05)}
C161 P160 0 {mc(C,0.05)}
R162 P161 P160 {mc(R,0.05)}
C162 P161 0 {mc(C,0.05)}
R163 P162 P161 {mc(R,0.05)}
C163 P162 0 {mc(C,0.05)}
R164 P163 P162 {mc(R,0.05)}
C164 P163 0 {mc(C,0.05)}
R165 P164 P163 {mc(R,0.05)}
C165 P164 0 {mc(C,0.05)}
R166 P165 P164 {mc(R,0.05)}
C166 P165 0 {mc(C,0.05)}
R167 P166 P165 {mc(R,0.05)}
C167 P166 0 {mc(C,0.05)}
R168 P167 P166 {mc(R,0.05)}
C168 P167 0 {mc(C,0.05)}
R169 P168 P167 {mc(R,0.05)}
C169 P168 0 {mc(C,0.05)}
R170 P169 P168 {mc(R,0.05)}
C170 P169 0 {mc(C,0.05)}
R171 P170 P169 {mc(R,0.05)}
C171 P170 0 {mc(C,0.05)}
R172 P171 P170 {mc(R,0.05)}
C172 P171 0 {mc(C,0.05)}
R173 P172 P171 {mc(R,0.05)}
C173 P172 0 {mc(C,0.05)}
R174 P173 P172 {mc(R,0.05)}
C174 P173 0 {mc(C,0.05)}
R175 P174 P173 {mc(R,0.05)}
C175 P174 0 {mc(C,0.05)}
R176 P175 P174 {mc(R,0.05)}
C176 P175 0 {mc(C,0.05)}
R177 P176 P175 {mc(R,0.05)}
C177 P176 0 {mc(C,0.05)}
R178 P177 P176 {mc(R,0.05)}
C178 P177 0 {mc(C,0.05)}
R179 P178 P177 {mc(R,0.05)}
C179 P178 0 {mc(C,0.05)}
R180 P179 P178 {mc(R,0.05)}
C180 P179 0 {mc(C,0.05)}
R181 P180 P179 {mc(R,0.05)}
C181 P180 0 {mc(C,0.05)}
R182 P181 P180 {mc(R,0.05)}
C182 P181 0 {mc(C,0.05)}
R183 P182 P181 {mc(R,0.05)}
C183 P182 0 {mc(C,0.05)}
R184 P183 P182 {mc(R,0.05)}
C184 P183 0 {mc(C,0.05)}
R185 P184 P183 {mc(R,0.05)}
C185 P184 0 {mc(C,0.05)}
R186 P185 P184 {mc(R,0.05)}
C186 P185 0 {mc(C,0.05)}
R187 P186 P185 {mc(R,0.05)}
C187 P186 0 {mc(C,0.05)}
R188 P187 P186 {mc(R,0.05)}
C188 P187 0 {mc(C,0.05)}
R189 P188 P187 {mc(R,0.05)}
C189 P188 0 {mc(C,0.05)}
R190 P189 P188 {mc(R,0.05)}
C190 P189 0 {mc(C,0.05)}
R191 P190 P189 {mc(R,0.05)}
C191 P190 0 {mc(C,0.05)}
R192 P191 P190 {mc(R,0.05)}
C192 P191 0 {mc(C,0.05)}
R193 P192 P191 {mc(R,0.05)}
C193 P192 0 {mc(C,0.05)}
R194 P193 P192 {mc(R,0.05)}
C194 P193 0 {mc(C,0.05)}
R195 P194 P193 {mc(R,0.05)}
C195 P194 0 {mc(C,0.05)}
R196 P195 P194 {mc(R,0.05)}
C196 P195 0 {mc(C,0.05)}
R197 P196 P195 {mc(R,0.05)}
C197 P196 0 {mc(C,0.05)}
R198 P197 P196 {mc(R,0.05)}
C198 P197 0 {mc(C,0.05)}
R199 P198 P197 {mc(R,0.05)}
C199 P198 0 {mc(C,0.05)}
R200 P199 P198 {mc(R,0.05)}
C200 P199 0 {mc(C,0.05)}
R201 P200 P199 {mc(R,0.05)}
C201 P200 0 {mc(C,0.05)}
R202 P201 P200 {mc(R,0.05)}
C202 P201 0 {mc(C,0.05)}
R203 P202 P201 {mc(R,0.05)}
C203 P202 0 {mc(C,0.05)}
R204 P203 P202 {mc(R,0.05)}
C204 P203 0 {mc(C,0.05)}
R205 P204 P203 {mc(R,0.05)}
C205 P204 0 {mc(C,0.05)}
R206 P205 P204 {mc(R,0.05)}
C206 P205 0 {mc(C,0.05)}
R207 P206 P205 {mc(R,0.05)}
C207 P206 0 {mc(C,0.05)}
R208 P207 P206 {mc(R,0.05)}
C208 P207 0 {mc(C,0.05)}
R209 P208 P207 {mc(R,0.05)}
C209 P208 0 {mc(C,0.05)}
R210 P209 P208 {mc(R,0.05)}
C210 P209 0 {mc(C,0.05)}
R211 P210 P209 {mc(R,0.05)}
C211 P210 0 {mc(C,0.05)}
R212 P211 P210 {mc(R,0.05)}
C212 P211 0 {mc(C,0.05)}
R213 P212 P211 {mc(R,0.05)}
C213 P212 0 {mc(C,0.05)}
R214 P213 P212 {mc(R,0.05)}
C214 P213 0 {mc(C,0.05)}
R215 P214 P213 {mc(R,0.05)}
C215 P214 0 {mc(C,0.05)}
R216 P215 P214 {mc(R,0.05)}
C216 P215 0 {mc(C,0.05)}
R217 P216 P215 {mc(R,0.05)}
C217 P216 0 {mc(C,0.05)}
R218 P217 P216 {mc(R,0.05)}
C218 P217 0 {mc(C,0.05)}
R219 P218 P217 {mc(R,0.05)}
C219 P218 0 {mc(C,0.05)}
R220 P219 P218 {mc(R,0.05)}
C220 P219 0 {mc(C,0.05)}
R221 P220 P219 {mc(R,0.05)}
C221 P220 0 {mc(C,0.05)}
R222 P221 P220 {mc(R,0.05)}
C222 P221 0 {mc(C,0.05)}
R223 P222 P221 {mc(R,0.05)}
C223 P222 0 {mc(C,0.05)}
R224 P223 P222 {mc(R,0.05)}
C224 P223 0 {mc(C,0.05)}
R225 P224 P223 {mc(R,0.05)}
C225 P224 0 {mc(C,0.05)}
R226 P225 P224 {mc(R,0.05)}
C226 P225 0 {mc(C,0.05)}
R227 P226 P225 {mc(R,0.05)}
C227 P226 0 {mc(C,0.05)}
R228 P227 P226 {mc(R,0.05)}
C228 P227 0 {mc(C,0.05)}
R229 P228 P227 {mc(R,0.05)}
C229 P228 0 {mc(C,0.05)}
R230 P229 P228 {mc(R,0.05)}
C230 P229 0 {mc(C,0.05)}
R231 P230 P229 {mc(R,0.05)}
C231 P230 0 {mc(C,0.05)}
R232 P231 P230 {mc(R,0.05)}
C232 P231 0 {mc(C,0.05)}
R233 P232 P231 {mc(R,0.05)}
C233 P232 0 {mc(C,0.05)}
R234 P233 P232 {mc(R,0.05)}
C234 P233 0 {mc(C,0.05)}
R235 P234 P233 {mc(R,0.05)}
C235 P234 0 {mc(C,0.05)}
R236 P235 P234 {mc(R,0.05)}
C236 P235 0 {mc(C,0.05)}
R237 P236 P235 {mc(R,0.05)}
C237 P236 0 {mc(C,0.05)}
R238 P237 P236 {mc(R,0.05)}
C238 P237 0 {mc(C,0.05)}
R239 P238 P237 {mc(R,0.05)}
C239 P238 0 {mc(C,0.05)}
R240 P239 P238 {mc(R,0.05)}
C240 P239 0 {mc(C,0.05)}
R241 P240 P239 {mc(R,0.05)}
C241 P240 0 {mc(C,0.05)}
R242 P241 P240 {mc(R,0.05)}
C242 P241 0 {mc(C,0.05)}
R243 P242 P241 {mc(R,0.05)}
C243 P242 0 {mc(C,0.05)}
R244 P243 P242 {mc(R,0.05)}
C244 P243 0 {mc(C,0.05)}
R245 P244 P243 {mc(R,0.05)}
C245 P244 0 {mc(C,0.05)}
R246 P245 P244 {mc(R,0.05)}
C246 P245 0 {mc(C,0.05)}
R247 P246 P245 {mc(R,0.05)}
C247 P246 0 {mc(C,0.05)}
R248 P247 P246 {mc(R,0.05)}
C248 P247 0 {mc(C,0.05)}
R249 P248 P247 {mc(R,0.05)}
C249 P248 0 {mc(C,0.05)}
R250 P249 P248 {mc(R,0.05)}
C250 P249 0 {mc(C,0.05)}
R251 P250 P249 {mc(R,0.05)}
C251 P250 0 {mc(C,0.05)}
R252 P251 P250 {mc(R,0.05)}
C252 P251 0 {mc(C,0.05)}
R253 P252 P251 {mc(R,0.05)}
C253 P252 0 {mc(C,0.05)}
R254 P253 P252 {mc(R,0.05)}
C254 P253 0 {mc(C,0.05)}
R255 P254 P253 {mc(R,0.05)}
C255 P254 0 {mc(C,0.05)}
R256 N002 P254 {mc(R,0.05)}
C256 N002 0 {mc(C,0.05)}
R257 P255 N002 {mc(R,0.05)}
C257 P255 0 {mc(C,0.05)}
R258 P256 P255 {mc(R,0.05)}
C258 P256 0 {mc(C,0.05)}
R259 P257 P256 {mc(R,0.05)}
C259 P257 0 {mc(C,0.05)}
R260 P258 P257 {mc(R,0.05)}
C260 P258 0 {mc(C,0.05)}
R261 P259 P258 {mc(R,0.05)}
C261 P259 0 {mc(C,0.05)}
R262 P260 P259 {mc(R,0.05)}
C262 P260 0 {mc(C,0.05)}
R263 P261 P260 {mc(R,0.05)}
C263 P261 0 {mc(C,0.05)}
R264 P262 P261 {mc(R,0.05)}
C264 P262 0 {mc(C,0.05)}
R265 P263 P262 {mc(R,0.05)}
C265 P263 0 {mc(C,0.05)}
R266 P264 P263 {mc(R,0.05)}
C266 P264 0 {mc(C,0.05)}
R267 P265 P264 {mc(R,0.05)}
C267 P265 0 {mc(C,0.05)}
R268 P266 P265 {mc(R,0.05)}
C268 P266 0 {mc(C,0.05)}
R269 P267 P266 {mc(R,0.05)}
C269 P267 0 {mc(C,0.05)}
R270 P268 P267 {mc(R,0.05)}
C270 P268 0 {mc(C,0.05)}
R271 P269 P268 {mc(R,0.05)}
C271 P269 0 {mc(C,0.05)}
R272 P270 P269 {mc(R,0.05)}
C272 P270 0 {mc(C,0.05)}
R273 P271 P270 {mc(R,0.05)}
C273 P271 0 {mc(C,0.05)}
R274 P272 P271 {mc(R,0.05)}
C274 P272 0 {mc(C,0.05)}
R275 P273 P272 {mc(R,0.05)}
C275 P273 0 {mc(C,0.05)}
R276 P274 P273 {mc(R,0.05)}
C276 P274 0 {mc(C,0.05)}
R277 P275 P274 {mc(R,0.05)}
C277 P275 0 {mc(C,0.05)}
R278 P276 P275 {mc(R,0.05)}
C278 P276 0 {mc(C,0.05)}
R279 P277 P276 {mc(R,0.05)}
C279 P277 0 {mc(C,0.05)}
R280 P278 P277 {mc(R,0.05)}
C280 P278 0 {mc(C,0.05)}
R281 P279 P278 {mc(R,0.05)}
C281 P279 0 {mc(C,0.05)}
R282 P280 P279 {mc(R,0.05)}
C282 P280 0 {mc(C,0.05)}
R283 P281 P280 {mc(R,0.05)}
C283 P281 0 {mc(C,0.05)}
R284 P282 P281 {mc(R,0.05)}
C284 P282 0 {mc(C,0.05)}
R285 P283 P282 {mc(R,0.05)}
C285 P283 0 {mc(C,0.05)}
R286 P284 P283 {mc(R,0.05)}
C286 P284 0 {mc(C,0.05)}
R287 P285 P284 {mc(R,0.05)}
C287 P285 0 {mc(C,0.05)}
R288 P286 P285 {mc(R,0.05)}
C288 P286 0 {mc(C,0.05)}
R289 P287 P286 {mc(R,0.05)}
C289 P287 0 {mc(C,0.05)}
R290 P288 P287 {mc(R,0.05)}
C290 P288 0 {mc(C,0.05)}
R291 P289 P288 {mc(R,0.05)}
C291 P289 0 {mc(C,0.05)}
R292 P290 P289 {mc(R,0.05)}
C292 P290 0 {mc(C,0.05)}
R293 P291 P290 {mc(R,0.05)}
C293 P291 0 {mc(C,0.05)}
R294 P292 P291 {mc(R,0.05)}
C294 P292 0 {mc(C,0.05)}
R295 P293 P292 {mc(R,0.05)}
C295 P293 0 {mc(C,0.05)}
R296 P294 P293 {mc(R,0.05)}
C296 P294 0 {mc(C,0.05)}
R297 P295 P294 {mc(R,0.05)}
C297 P295 0 {mc(C,0.05)}
R298 P296 P295 {mc(R,0.05)}
C298 P296 0 {mc(C,0.05)}
R299 P297 P296 {mc(R,0.05)}
C299 P297 0 {mc(C,0.05)}
R300 P298 P297 {mc(R,0.05)}
C300 P298 0 {mc(C,0.05)}
R301 P299 P298 {mc(R,0.05)}
C301 P299 0 {mc(C,0.05)}
R302 P300 P299 {mc(R,0.05)}
C302 P300 0 {mc(C,0.05)}
R303 P301 P300 {mc(R,0.05)}
C303 P301 0 {mc(C,0.05)}
R304 P302 P301 {mc(R,0.05)}
C304 P302 0 {mc(C,0.05)}
R305 P303 P302 {mc(R,0.05)}
C305 P303 0 {mc(C,0.05)}
R306 P304 P303 {mc(R,0.05)}
C306 P304 0 {mc(C,0.05)}
R307 P305 P304 {mc(R,0.05)}
C307 P305 0 {mc(C,0.05)}
R308 P306 P305 {mc(R,0.05)}
C308 P306 0 {mc(C,0.05)}
R309 P307 P306 {mc(R,0.05)}
C309 P307 0 {mc(C,0.05)}
R310 P308 P307 {mc(R,0.05)}
C310 P308 0 {mc(C,0.05)}
R311 P309 P308 {mc(R,0.05)}
C311 P309 0 {mc(C,0.05)}
R312 P310 P309 {mc(R,0.05)}
C312 P310 0 {mc(C,0.05)}
R313 P311 P310 {mc(R,0.05)}
C313 P311 0 {mc(C,0.05)}
R314 P312 P311 {mc(R,0.05)}
C314 P312 0 {mc(C,0.05)}
R315 P313 P312 {mc(R,0.05)}
C315 P313 0 {mc(C,0.05)}
R316 P314 P313 {mc(R,0.05)}
C316 P314 0 {mc(C,0.05)}
R317 P315 P314 {mc(R,0.05)}
C317 P315 0 {mc(C,0.05)}
R318 P316 P315 {mc(R,0.05)}
C318 P316 0 {mc(C,0.05)}
R319 P317 P316 {mc(R,0.05)}
C319 P317 0 {mc(C,0.05)}
R320 P318 P317 {mc(R,0.05)}
C320 P318 0 {mc(C,0.05)}
R321 P319 P318 {mc(R,0.05)}
C321 P319 0 {mc(C,0.05)}
R322 P320 P319 {mc(R,0.05)}
C322 P320 0 {mc(C,0.05)}
R323 P321 P320 {mc(R,0.05)}
C323 P321 0 {mc(C,0.05)}
R324 P322 P321 {mc(R,0.05)}
C324 P322 0 {mc(C,0.05)}
R325 P323 P322 {mc(R,0.05)}
C325 P323 0 {mc(C,0.05)}
R326 P324 P323 {mc(R,0.05)}
C326 P324 0 {mc(C,0.05)}
R327 P325 P324 {mc(R,0.05)}
C327 P325 0 {mc(C,0.05)}
R328 P326 P325 {mc(R,0.05)}
C328 P326 0 {mc(C,0.05)}
R329 P327 P326 {mc(R,0.05)}
C329 P327 0 {mc(C,0.05)}
R330 P328 P327 {mc(R,0.05)}
C330 P328 0 {mc(C,0.05)}
R331 P329 P328 {mc(R,0.05)}
C331 P329 0 {mc(C,0.05)}
R332 P330 P329 {mc(R,0.05)}
C332 P330 0 {mc(C,0.05)}
R333 P331 P330 {mc(R,0.05)}
C333 P331 0 {mc(C,0.05)}
R334 P332 P331 {mc(R,0.05)}
C334 P332 0 {mc(C,0.05)}
R335 P333 P332 {mc(R,0.05)}
C335 P333 0 {mc(C,0.05)}
R336 P334 P333 {mc(R,0.05)}
C336 P334 0 {mc(C,0.05)}
R337 P335 P334 {mc(R,0.05)}
C337 P335 0 {mc(C,0.05)}
R338 P336 P335 {mc(R,0.05)}
C338 P336 0 {mc(C,0.05)}
R339 P337 P336 {mc(R,0.05)}
C339 P337 0 {mc(C,0.05)}
R340 P338 P337 {mc(R,0.05)}
C340 P338 0 {mc(C,0.05)}
R341 P339 P338 {mc(R,0.05)}
C341 P339 0 {mc(C,0.05)}
R342 P340 P339 {mc(R,0.05)}
C342 P340 0 {mc(C,0.05)}
R343 P341 P340 {mc(R,0.05)}
C343 P341 0 {mc(C,0.05)}
R344 P342 P341 {mc(R,0.05)}
C344 P342 0 {mc(C,0.05)}
R345 P343 P342 {mc(R,0.05)}
C345 P343 0 {mc(C,0.05)}
R346 P344 P343 {mc(R,0.05)}
C346 P344 0 {mc(C,0.05)}
R347 P345 P344 {mc(R,0.05)}
C347 P345 0 {mc(C,0.05)}
R348 P346 P345 {mc(R,0.05)}
C348 P346 0 {mc(C,0.05)}
R349 P347 P346 {mc(R,0.05)}
C349 P347 0 {mc(C,0.05)}
R350 P348 P347 {mc(R,0.05)}
C350 P348 0 {mc(C,0.05)}
R351 P349 P348 {mc(R,0.05)}
C351 P349 0 {mc(C,0.05)}
R352 P350 P349 {mc(R,0.05)}
C352 P350 0 {mc(C,0.05)}
R353 P351 P350 {mc(R,0.05)}
C353 P351 0 {mc(C,0.05)}
R354 P352 P351 {mc(R,0.05)}
C354 P352 0 {mc(C,0.05)}
R355 P353 P352 {mc(R,0.05)}
C355 P353 0 {mc(C,0.05)}
R356 P354 P353 {mc(R,0.05)}
C356 P354 0 {mc(C,0.05)}
R357 P355 P354 {mc(R,0.05)}
C357 P355 0 {mc(C,0.05)}
R358 P356 P355 {mc(R,0.05)}
C358 P356 0 {mc(C,0.05)}
R359 P357 P356 {mc(R,0.05)}
C359 P357 0 {mc(C,0.05)}
R360 P358 P357 {mc(R,0.05)}
C360 P358 0 {mc(C,0.05)}
R361 P359 P358 {mc(R,0.05)}
C361 P359 0 {mc(C,0.05)}
R362 P360 P359 {mc(R,0.05)}
C362 P360 0 {mc(C,0.05)}
R363 P361 P360 {mc(R,0.05)}
C363 P361 0 {mc(C,0.05)}
R364 P362 P361 {mc(R,0.05)}
C364 P362 0 {mc(C,0.05)}
R365 P363 P362 {mc(R,0.05)}
C365 P363 0 {mc(C,0.05)}
R366 P364 P363 {mc(R,0.05)}
C366 P364 0 {mc(C,0.05)}
R367 P365 P364 {mc(R,0.05)}
C367 P365 0 {mc(C,0.05)}
R368 P366 P365 {mc(R,0.05)}
C368 P366 0 {mc(C,0.05)}
R369 P367 P366 {mc(R,0.05)}
C369 P367 0 {mc(C,0.05)}
R370 P368 P367 {mc(R,0.05)}
C370 P368 0 {mc(C,0.05)}
R371 P369 P368 {mc(R,0.05)}
C371 P369 0 {mc(C,0.05)}
R372 P370 P369 {mc(R,0.05)}
C372 P370 0 {mc(C,0.05)}
R373 P371 P370 {mc(R,0.05)}
C373 P371 0 {mc(C,0.05)}
R374 P372 P371 {mc(R,0.05)}
C374 P372 0 {mc(C,0.05)}
R375 P373 P372 {mc(R,0.05)}
C375 P373 0 {mc(C,0.05)}
R376 P374 P373 {mc(R,0.05)}
C376 P374 0 {mc(C,0.05)}
R377 P375 P374 {mc(R,0.05)}
C377 P375 0 {mc(C,0.05)}
R378 P376 P375 {mc(R,0.05)}
C378 P376 0 {mc(C,0.05)}
R379 P377 P376 {mc(R,0.05)}
C379 P377 0 {mc(C,0.05)}
R380 P378 P377 {mc(R,0.05)}
C380 P378 0 {mc(C,0.05)}
R381 P379 P378 {mc(R,0.05)}
C381 P379 0 {mc(C,0.05)}
R382 P380 P379 {mc(R,0.05)}
C382 P380 0 {mc(C,0.05)}
R383 P381 P380 {mc(R,0.05)}
C383 P381 0 {mc(C,0.05)}
R384 N003 P381 {mc(R,0.05)}
R385 P382 N003 {mc(R,0.05)}
C385 P382 0 {mc(C,0.05)}
R386 P383 P382 {mc(R,0.05)}
C386 P383 0 {mc(C,0.05)}
R387 P384 P383 {mc(R,0.05)}
C387 P384 0 {mc(C,0.05)}
R388 P385 P384 {mc(R,0.05)}
C388 P385 0 {mc(C,0.05)}
R389 P386 P385 {mc(R,0.05)}
C389 P386 0 {mc(C,0.05)}
R390 P387 P386 {mc(R,0.05)}
C390 P387 0 {mc(C,0.05)}
R391 P388 P387 {mc(R,0.05)}
C391 P388 0 {mc(C,0.05)}
R392 P389 P388 {mc(R,0.05)}
C392 P389 0 {mc(C,0.05)}
R393 P390 P389 {mc(R,0.05)}
C393 P390 0 {mc(C,0.05)}
R394 P391 P390 {mc(R,0.05)}
C394 P391 0 {mc(C,0.05)}
R395 P392 P391 {mc(R,0.05)}
C395 P392 0 {mc(C,0.05)}
R396 P393 P392 {mc(R,0.05)}
C396 P393 0 {mc(C,0.05)}
R397 P394 P393 {mc(R,0.05)}
C397 P394 0 {mc(C,0.05)}
R398 P395 P394 {mc(R,0.05)}
C398 P395 0 {mc(C,0.05)}
R399 P396 P395 {mc(R,0.05)}
C399 P396 0 {mc(C,0.05)}
R400 P397 P396 {mc(R,0.05)}
C400 P397 0 {mc(C,0.05)}
R401 P398 P397 {mc(R,0.05)}
C401 P398 0 {mc(C,0.05)}
R402 P399 P398 {mc(R,0.05)}
C402 P399 0 {mc(C,0.05)}
R403 P400 P399 {mc(R,0.05)}
C403 P400 0 {mc(C,0.05)}
R404 P401 P400 {mc(R,0.05)}
C404 P401 0 {mc(C,0.05)}
R405 P402 P401 {mc(R,0.05)}
C405 P402 0 {mc(C,0.05)}
R406 P403 P402 {mc(R,0.05)}
C406 P403 0 {mc(C,0.05)}
R407 P404 P403 {mc(R,0.05)}
C407 P404 0 {mc(C,0.05)}
R408 P405 P404 {mc(R,0.05)}
C408 P405 0 {mc(C,0.05)}
R409 P406 P405 {mc(R,0.05)}
C409 P406 0 {mc(C,0.05)}
R410 P407 P406 {mc(R,0.05)}
C410 P407 0 {mc(C,0.05)}
R411 P408 P407 {mc(R,0.05)}
C411 P408 0 {mc(C,0.05)}
R412 P409 P408 {mc(R,0.05)}
C412 P409 0 {mc(C,0.05)}
R413 P410 P409 {mc(R,0.05)}
C413 P410 0 {mc(C,0.05)}
R414 P411 P410 {mc(R,0.05)}
C414 P411 0 {mc(C,0.05)}
R415 P412 P411 {mc(R,0.05)}
C415 P412 0 {mc(C,0.05)}
R416 P413 P412 {mc(R,0.05)}
C416 P413 0 {mc(C,0.05)}
R417 P414 P413 {mc(R,0.05)}
C417 P414 0 {mc(C,0.05)}
R418 P415 P414 {mc(R,0.05)}
C418 P415 0 {mc(C,0.05)}
R419 P416 P415 {mc(R,0.05)}
C419 P416 0 {mc(C,0.05)}
R420 P417 P416 {mc(R,0.05)}
C420 P417 0 {mc(C,0.05)}
R421 P418 P417 {mc(R,0.05)}
C421 P418 0 {mc(C,0.05)}
R422 P419 P418 {mc(R,0.05)}
C422 P419 0 {mc(C,0.05)}
R423 P420 P419 {mc(R,0.05)}
C423 P420 0 {mc(C,0.05)}
R424 P421 P420 {mc(R,0.05)}
C424 P421 0 {mc(C,0.05)}
R425 P422 P421 {mc(R,0.05)}
C425 P422 0 {mc(C,0.05)}
R426 P423 P422 {mc(R,0.05)}
C426 P423 0 {mc(C,0.05)}
R427 P424 P423 {mc(R,0.05)}
C427 P424 0 {mc(C,0.05)}
R428 P425 P424 {mc(R,0.05)}
C428 P425 0 {mc(C,0.05)}
R429 P426 P425 {mc(R,0.05)}
C429 P426 0 {mc(C,0.05)}
R430 P427 P426 {mc(R,0.05)}
C430 P427 0 {mc(C,0.05)}
R431 P428 P427 {mc(R,0.05)}
C431 P428 0 {mc(C,0.05)}
R432 P429 P428 {mc(R,0.05)}
C432 P429 0 {mc(C,0.05)}
R433 P430 P429 {mc(R,0.05)}
C433 P430 0 {mc(C,0.05)}
R434 P431 P430 {mc(R,0.05)}
C434 P431 0 {mc(C,0.05)}
R435 P432 P431 {mc(R,0.05)}
C435 P432 0 {mc(C,0.05)}
R436 P433 P432 {mc(R,0.05)}
C436 P433 0 {mc(C,0.05)}
R437 P434 P433 {mc(R,0.05)}
C437 P434 0 {mc(C,0.05)}
R438 P435 P434 {mc(R,0.05)}
C438 P435 0 {mc(C,0.05)}
R439 P436 P435 {mc(R,0.05)}
C439 P436 0 {mc(C,0.05)}
R440 P437 P436 {mc(R,0.05)}
C440 P437 0 {mc(C,0.05)}
R441 P438 P437 {mc(R,0.05)}
C441 P438 0 {mc(C,0.05)}
R442 P439 P438 {mc(R,0.05)}
C442 P439 0 {mc(C,0.05)}
R443 P440 P439 {mc(R,0.05)}
C443 P440 0 {mc(C,0.05)}
R444 P441 P440 {mc(R,0.05)}
C444 P441 0 {mc(C,0.05)}
R445 P442 P441 {mc(R,0.05)}
C445 P442 0 {mc(C,0.05)}
R446 P443 P442 {mc(R,0.05)}
C446 P443 0 {mc(C,0.05)}
R447 P444 P443 {mc(R,0.05)}
C447 P444 0 {mc(C,0.05)}
R448 P445 P444 {mc(R,0.05)}
C448 P445 0 {mc(C,0.05)}
R449 P446 P445 {mc(R,0.05)}
C449 P446 0 {mc(C,0.05)}
R450 P447 P446 {mc(R,0.05)}
C450 P447 0 {mc(C,0.05)}
R451 P448 P447 {mc(R,0.05)}
C451 P448 0 {mc(C,0.05)}
R452 P449 P448 {mc(R,0.05)}
C452 P449 0 {mc(C,0.05)}
R453 P450 P449 {mc(R,0.05)}
C453 P450 0 {mc(C,0.05)}
R454 P451 P450 {mc(R,0.05)}
C454 P451 0 {mc(C,0.05)}
R455 P452 P451 {mc(R,0.05)}
C455 P452 0 {mc(C,0.05)}
R456 P453 P452 {mc(R,0.05)}
C456 P453 0 {mc(C,0.05)}
R457 P454 P453 {mc(R,0.05)}
C457 P454 0 {mc(C,0.05)}
R458 P455 P454 {mc(R,0.05)}
C458 P455 0 {mc(C,0.05)}
R459 P456 P455 {mc(R,0.05)}
C459 P456 0 {mc(C,0.05)}
R460 P457 P456 {mc(R,0.05)}
C460 P457 0 {mc(C,0.05)}
R461 P458 P457 {mc(R,0.05)}
C461 P458 0 {mc(C,0.05)}
R462 P459 P458 {mc(R,0.05)}
C462 P459 0 {mc(C,0.05)}
R463 P460 P459 {mc(R,0.05)}
C463 P460 0 {mc(C,0.05)}
R464 P461 P460 {mc(R,0.05)}
C464 P461 0 {mc(C,0.05)}
R465 P462 P461 {mc(R,0.05)}
C465 P462 0 {mc(C,0.05)}
R466 P463 P462 {mc(R,0.05)}
C466 P463 0 {mc(C,0.05)}
R467 P464 P463 {mc(R,0.05)}
C467 P464 0 {mc(C,0.05)}
R468 P465 P464 {mc(R,0.05)}
C468 P465 0 {mc(C,0.05)}
R469 P466 P465 {mc(R,0.05)}
C469 P466 0 {mc(C,0.05)}
R470 P467 P466 {mc(R,0.05)}
C470 P467 0 {mc(C,0.05)}
R471 P468 P467 {mc(R,0.05)}
C471 P468 0 {mc(C,0.05)}
R472 P469 P468 {mc(R,0.05)}
C472 P469 0 {mc(C,0.05)}
R473 P470 P469 {mc(R,0.05)}
C473 P470 0 {mc(C,0.05)}
R474 P471 P470 {mc(R,0.05)}
C474 P471 0 {mc(C,0.05)}
R475 P472 P471 {mc(R,0.05)}
C475 P472 0 {mc(C,0.05)}
R476 P473 P472 {mc(R,0.05)}
C476 P473 0 {mc(C,0.05)}
R477 P474 P473 {mc(R,0.05)}
C477 P474 0 {mc(C,0.05)}
R478 P475 P474 {mc(R,0.05)}
C478 P475 0 {mc(C,0.05)}
R479 P476 P475 {mc(R,0.05)}
C479 P476 0 {mc(C,0.05)}
R480 P477 P476 {mc(R,0.05)}
C480 P477 0 {mc(C,0.05)}
R481 P478 P477 {mc(R,0.05)}
C481 P478 0 {mc(C,0.05)}
R482 P479 P478 {mc(R,0.05)}
C482 P479 0 {mc(C,0.05)}
R483 P480 P479 {mc(R,0.05)}
C483 P480 0 {mc(C,0.05)}
R484 P481 P480 {mc(R,0.05)}
C484 P481 0 {mc(C,0.05)}
R485 P482 P481 {mc(R,0.05)}
C485 P482 0 {mc(C,0.05)}
R486 P483 P482 {mc(R,0.05)}
C486 P483 0 {mc(C,0.05)}
R487 P484 P483 {mc(R,0.05)}
C487 P484 0 {mc(C,0.05)}
R488 P485 P484 {mc(R,0.05)}
C488 P485 0 {mc(C,0.05)}
R489 P486 P485 {mc(R,0.05)}
C489 P486 0 {mc(C,0.05)}
R490 P487 P486 {mc(R,0.05)}
C490 P487 0 {mc(C,0.05)}
R491 P488 P487 {mc(R,0.05)}
C491 P488 0 {mc(C,0.05)}
R492 P489 P488 {mc(R,0.05)}
C492 P489 0 {mc(C,0.05)}
R493 P490 P489 {mc(R,0.05)}
C493 P490 0 {mc(C,0.05)}
R494 P491 P490 {mc(R,0.05)}
C494 P491 0 {mc(C,0.05)}
R495 P492 P491 {mc(R,0.05)}
C495 P492 0 {mc(C,0.05)}
R496 P493 P492 {mc(R,0.05)}
C496 P493 0 {mc(C,0.05)}
R497 P494 P493 {mc(R,0.05)}
C497 P494 0 {mc(C,0.05)}
R498 P495 P494 {mc(R,0.05)}
C498 P495 0 {mc(C,0.05)}
R499 P496 P495 {mc(R,0.05)}
C499 P496 0 {mc(C,0.05)}
R500 P497 P496 {mc(R,0.05)}
C500 P497 0 {mc(C,0.05)}
R501 P498 P497 {mc(R,0.05)}
C501 P498 0 {mc(C,0.05)}
R502 P499 P498 {mc(R,0.05)}
C502 P499 0 {mc(C,0.05)}
R503 P500 P499 {mc(R,0.05)}
C503 P500 0 {mc(C,0.05)}
R504 P501 P500 {mc(R,0.05)}
C504 P501 0 {mc(C,0.05)}
R505 P502 P501 {mc(R,0.05)}
C505 P502 0 {mc(C,0.05)}
R506 P503 P502 {mc(R,0.05)}
C506 P503 0 {mc(C,0.05)}
R507 P504 P503 {mc(R,0.05)}
C507 P504 0 {mc(C,0.05)}
R508 P505 P504 {mc(R,0.05)}
C508 P505 0 {mc(C,0.05)}
R509 P506 P505 {mc(R,0.05)}
C509 P506 0 {mc(C,0.05)}
R510 P507 P506 {mc(R,0.05)}
C510 P507 0 {mc(C,0.05)}
R511 P508 P507 {mc(R,0.05)}
C511 P508 0 {mc(C,0.05)}
R512 R P508 {mc(R,0.05)}
C512 R 0 {mc(C,0.05)}
C384 N003 0 {mc(C,0.05)}
.ends transmission_line

.subckt dram_cell SWL B Cell
M7 B SWL Cell 0 nmoslp l={mc(access_tran_L,mc_variation)} w={mc(access_tran_W,mc_variation)}
cell Cell N001 {mc(capacitance, mc_variation)} IC={-common_plate + {cell_init_voltage_X}}
V_PV1 N001 0 {common_plate}
.ends dram_cell

.subckt equalizer BL BLB PRE HV ePRE
M1 BLB PRE BL 0 NMOS l={mc(SA_eq_L,mc_variation)} w={mc(SA_eq_W, mc_variation)}
M2 BL PRE HV 0 NMOS l={mc(SA_eq_L_half,mc_variation)} w={mc(SA_eq_W_half,mc_variation)}
M3 HV ePRE BLB 0 NMOS l={mc(SA_eq_L_half,mc_variation)} w={mc(SA_eq_W_half,mc_variation)}
.ends equalizer

.subckt sense_amplifier NSET PSET PSET_od BL BLB VARY VOD
M1 N002 NSET 0 0 NMOS l={mc({SA_nset_L_}, mc_variation)} w={mc({SA_nset_W_}, mc_variation)}
M2 BLB BL N002 0 NMOS l={mc({SA_nmos_L_},mc_variation)} w={mc({SA_nmos_W_}, mc_variation)}
M3 BL BLB N002 0 NMOS l={mc({SA_nmos_L_},mc_variation)} w={mc({SA_nmos_W_},mc_variation)}
M10 BLB BL N001 VARY PMOS l={mc({SA_pmos_L_}, mc_variation)} w={mc({SA_pmos_W_},mc_variation)}
M11 BL BLB N001 VARY PMOS l={mc({SA_pmos_L_}, mc_variation)} w={mc({SA_pmos_W_}, mc_variation)}
M4 VOD PSET_od N001 0 NMOS l={mc({SA_pset_Lod_}, mc_variation)} w={mc({SA_pset_Wod_}, mc_variation)}
M5 N001 PSET VARY 0 NMOS l={mc({SA_pset_L_}, mc_variation)} w={mc({SA_pset_W_}, mc_variation)}
.ends sense_amplifier

.model NMOS NMOS
.model PMOS PMOS
.lib standard.mos
.include ./22nm_HP.pm
.tran {sim_duration}
.param mc_variation=0.05
.param capacitance={17f}
.param C_per_cell={0.04f}
.param access_tran_L={208nm}
.param access_tran_W={129n}
.param R_per_cell=880*41.5/{cells_per_BL}
* Bitline Resistance
.param SA_eq_L=100n
.param SA_eq_W=100n
.param cells_per_BL=512
.param vary_voltage=1V
.param wordline_voltage=2.5V
.param common_plate={vary_voltage/2}
.param nsense=4ns
.param WL_C_per_cell=0.078fF
* Wordline Parasitics
.param cells_per_LWL=1024
.param WL_R_per_cell=760*85.5/{cells_per_LWL}
.TEMP 85
.param tras=32n
.param trise=0.5n
.param SA_nmos_L_w={SA_nmos_L_init}
.param SA_nmos_W_w={SA_nmos_W_init}
.param SA_pmos_L_w={SA_pmos_L_init}
.param SA_pmos_W_w={SA_pmos_W_init}
.param SA_nset_L_w={SA_nset_L_init}
.param SA_nset_W_w={SA_nset_W_init}
.param SA_pset_Lod_w={SA_pset_L_init_od}
.param SA_pset_Wod_w={SA_pset_W_init_od}
.param time_eq=5n time_eq_1={time_eq}
.param sim_duration={time_eq+{tras}+1n}
.param SA_eq_L_half=100n
.param SA_eq_W_half=188n
.param SA_nmos_L_init={107nm}
.param SA_nmos_W_init={530nm}
.param SA_pmos_L_init={106nm}
.param SA_pmos_W_init={380nm}
.param SA_nset_L_init={90nm}
.param SA_nset_W_init={149um/512}
.param SA_pset_L_init_od={100nm}
.param SA_pset_W_init_od={(54.808um+47.222um)/512}
.param SA_pset_W_init={1.44*4um*2/512}
.ic V(bl_end)={vary_voltage/2} V(bl_init)={vary_voltage/2} V(blb)={vary_voltage/2}
.param eq_voltage=1.5V
.param LIO_C_per_cell={LIO_um*LIO_C_per_um/512}
.param LIO_C_per_um=0.306f
* LIO Resistance
.param LIO_um=85.5
* Here, CELL is intended of the transmission line to simulate C/R
.param LIO_block_area_ums={0.20*0.22*{LIO_um/0.20}}
.param LIO_R={LIO_block_area_ums*0.092}
.param LIO_R_per_cell={LIO_R/512}
.param MIO_C_per_cell={MIO_um*LIO_C_per_um/512}
.param MIO_C_per_um=0.217f
* MIO Resistance
.param MIO_um=1900
* Here, CELL is intended of the transmission line to simulate C/R
.param MIO_block_area_ums={0.40*0.88*{MIO_um/0.40}}
.param MIO_R={MIO_block_area_ums*0.042}
.param MIO_R_per_cell={MIO_R/512}
.param vperi=1.1v
.param SA_nmos_L_B={0.10um}
.param SA_nmos_W_B={1.7um}
.param SA_nmos_L_csl={0.09um}
.param SA_nmos_W_csl={0.30um}
.param SA_nmos_L_write={0.06um}
.param SA_nmos_W_write={1.44um*5}
.param SA_pmos_L_write={0.06um}
.param SA_pmos_W_write={2.0um}
.param offs=0.220
.param SA_pset_L_init={100nm}
.param voltage_od=1.4V
.param SA_pset_L_w={SA_pset_L_init}
.param SA_pset_W_w={SA_pset_W_init}
.param time_od=3n
.param value_cr=1
* Voltage sources
* Control sources
* SWD and SWL
* Simulation settings
* Transistors sizes
* Sensing circuit
* Column select (runs along an entire mat)
* LIO
* MIO
* Connection to the MIO (runs along all mats)
* Write transistors
.include ./22nm_LP.pm
.backanno
.end